# EAGLE design MRCS-Enhanced-Optical-Position-Detector (EAGLE 7.7.0)
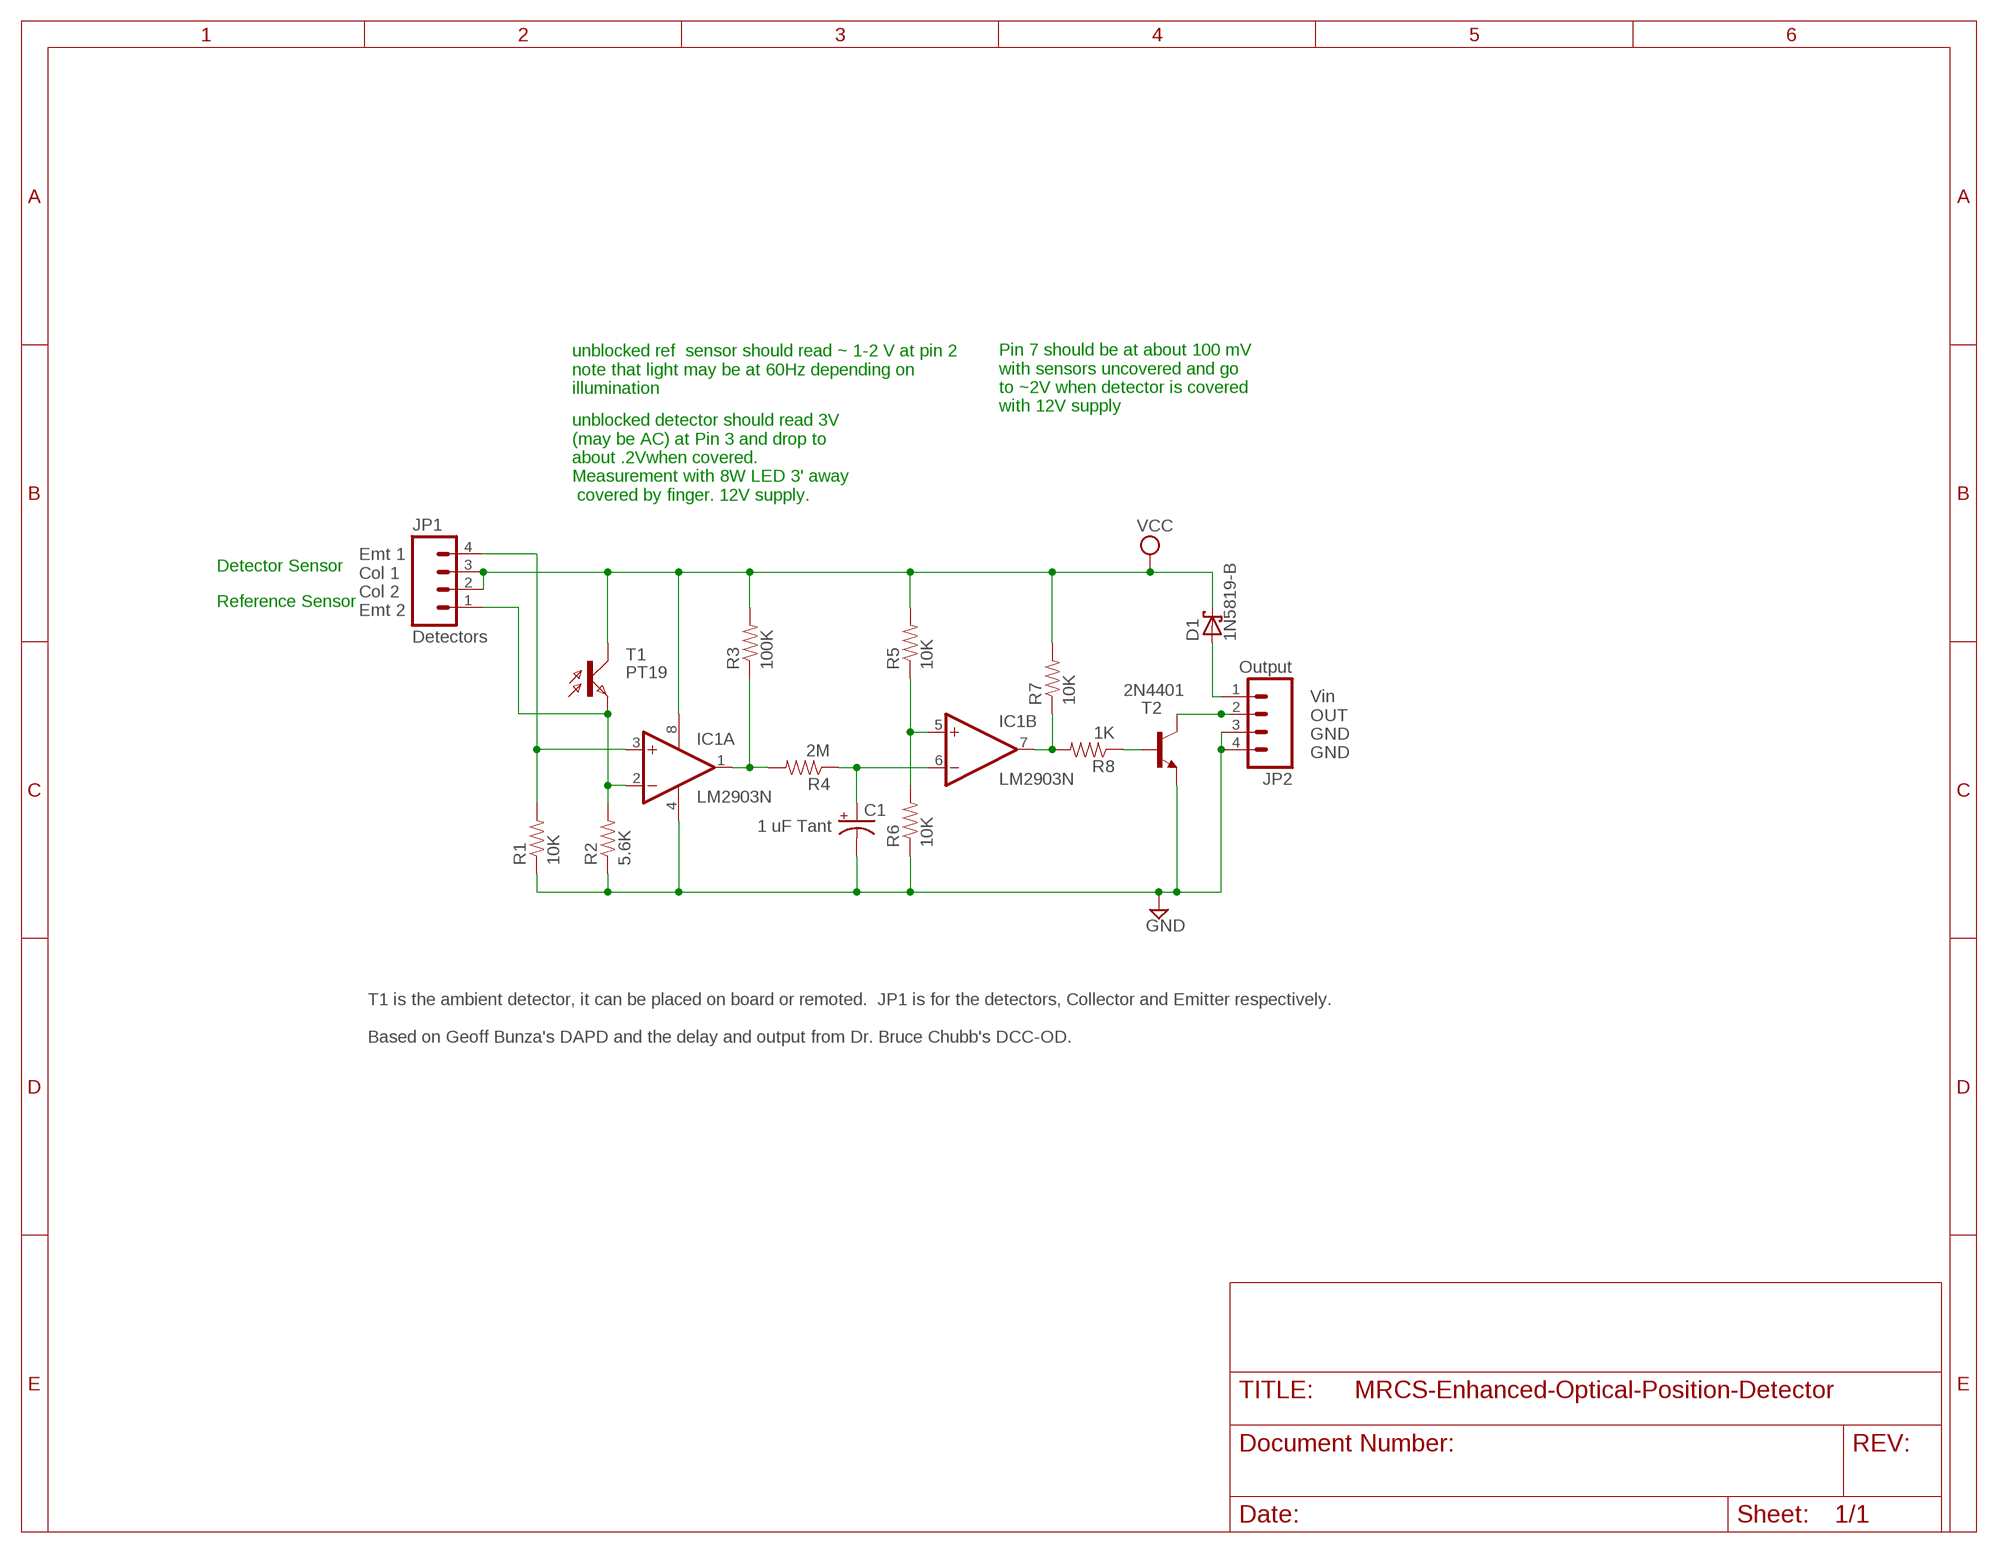
[diagram p0: schematic, sheet 1]

## Parts
C1  1 uF Tant  CPOL-USE2.5-5  [E2,5-5]
D1  1N5819-B  [DO41-7.6]
IC1  LM2903N  [DIL08]
JP1  Detectors  M04LOCK  [1X04_LOCK]
JP2  Output  M04LOCK  [1X04_LOCK]
R1  10K  RESISTORPTH-1/4W  [AXIAL-0.4]
R2  5.6K  RESISTORPTH-1/4W  [AXIAL-0.4]
R3  100K  RESISTORPTH-1/4W  [AXIAL-0.4]
R4  2M  RESISTORPTH-1/4W  [AXIAL-0.4]
R5  10K  RESISTORPTH-1/4W  [AXIAL-0.4]
R6  10K  RESISTORPTH-1/4W  [AXIAL-0.4]
R7  10K  RESISTORPTH-1/4W  [AXIAL-0.4]
R8  1K  RESISTORPTH-1/4W  [AXIAL-0.4]
T1  PT19  BPX81  [BPX81]
T2  2N4401  2N3904-NPN-TO92-EBC  [TO92-EBC]

## Nets
GND: C1.- IC1.4(P:V-) JP2.3 JP2.4 R1.P$1 R2.P$1 R6.P$1 T2.E
N$1: IC1.2(A:-IN) JP1.1 R2.P$2 T1.E
N$2: C1.+ IC1.6(B:-IN) R4.P$1
N$3: IC1.3(A:+IN) JP1.4 R1.P$2
N$4: IC1.1(A:OUT) R3.P$1 R4.P$2
N$5: IC1.7(B:OUT) R7.P$1 R8.P$2
N$6: IC1.5(B:+IN) R5.P$1 R6.P$2
N$7: R8.P$1 T2.B
N$8: JP2.2 T2.C
VCC: D1.C IC1.8(P:V+) JP1.2 JP1.3 R3.P$2 R5.P$2 R7.P$2 T1.C
VIN: D1.A JP2.1

## Notes on the sheet
- unblocked ref  sensor should read ~ 1-2 V at pin 2
  note that light may be at 60Hz depending on
  illumination
- Pin 7 should be at about 100 mV
  with sensors uncovered and go
  to ~2V when detector is covered
  with 12V supply
- unblocked detector should read 3V 
  (may be AC) at Pin 3 and drop to
  about .2Vwhen covered.
  Measurement with 8W LED 3' away
   covered by finger. 12V supply.
- Detector Sensor
- Reference Sensor
- Emt 1
  Col 1
  Col 2
  Emt 2
- Vin
  OUT
  GND
  GND
- T1 is the ambient detector, it can be placed on board or remoted.  JP1 is for the detectors, Collector and Emitter respectively.
  
  Based on Geoff Bunza's DAPD and the delay and output from Dr. Bruce Chubb's DCC-OD.

## Library data of the parts
C1 = rcl:CPOL-US: POLARIZED CAPACITOR, American symbol
D1 = diode:1N581*: 1.0A SCHOTTKY BARRIER RECTIFIER Source: http://www.diodes.com/datasheets/ds23001.pdf
IC1 = linear:LM2903: COMPARATOR
JP1 JP2 = SparkFun-Connectors:M04: Header 4 Standard 4-pin 0.1" header. Use with straight break away headers (SKU : PRT-00116), right angle break away headers (PRT-00553), swiss pins (PRT-00743), machine pins (PRT-00117), and female headers (PRT-00115). Molex polarized connector foot print use with SKU : PRT-08231 with associated crimp pins and housings. 1MM SMD Version SKU: PRT-10208
R1-R8 = SparkFun-Resistors:RESISTOR: Resistor Basic schematic elements and footprints for 0603, 1206, and PTH resistors.
T1 = opto-trans-siemens:BPX81: PHOTO TRANSISTOR; OC_FARNELL: unknown; OC_NEWARK: unknown
T2 = transistor-neu-to92:*-NPN-: NPN Transistror

## Board
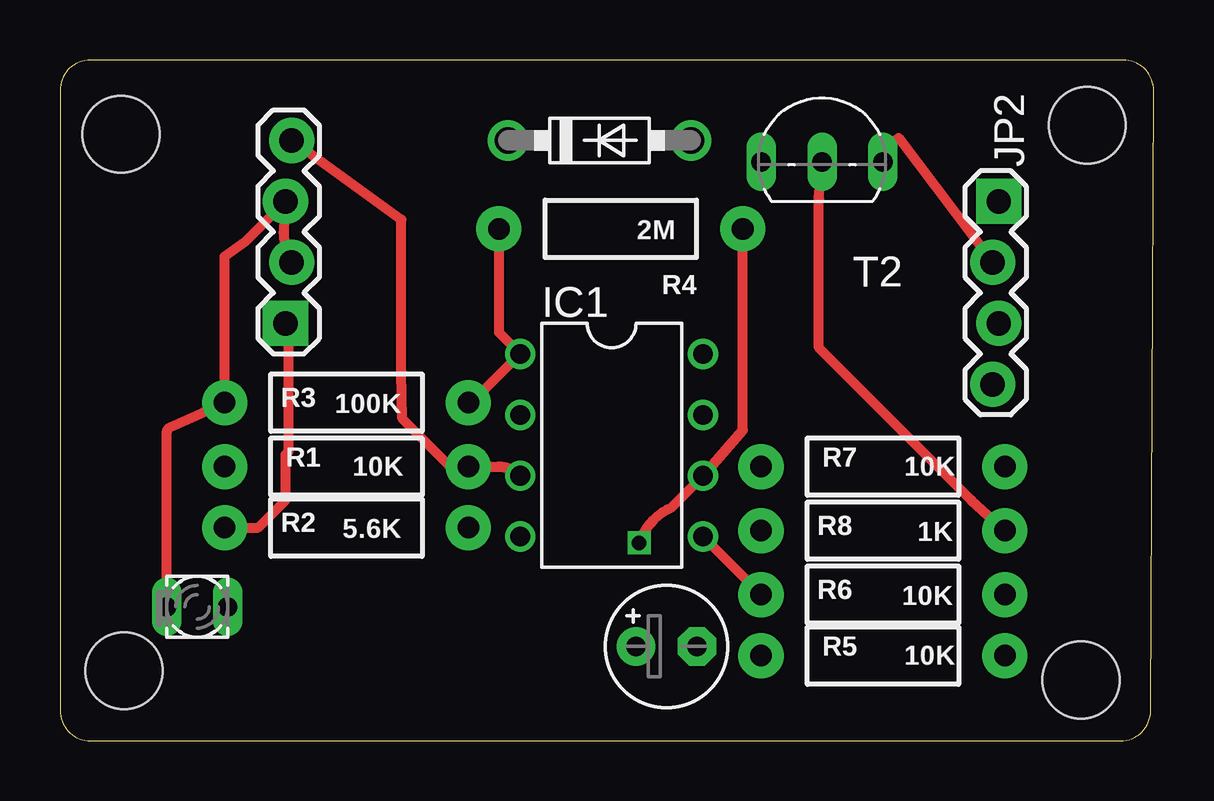
[diagram p1: board, top side]
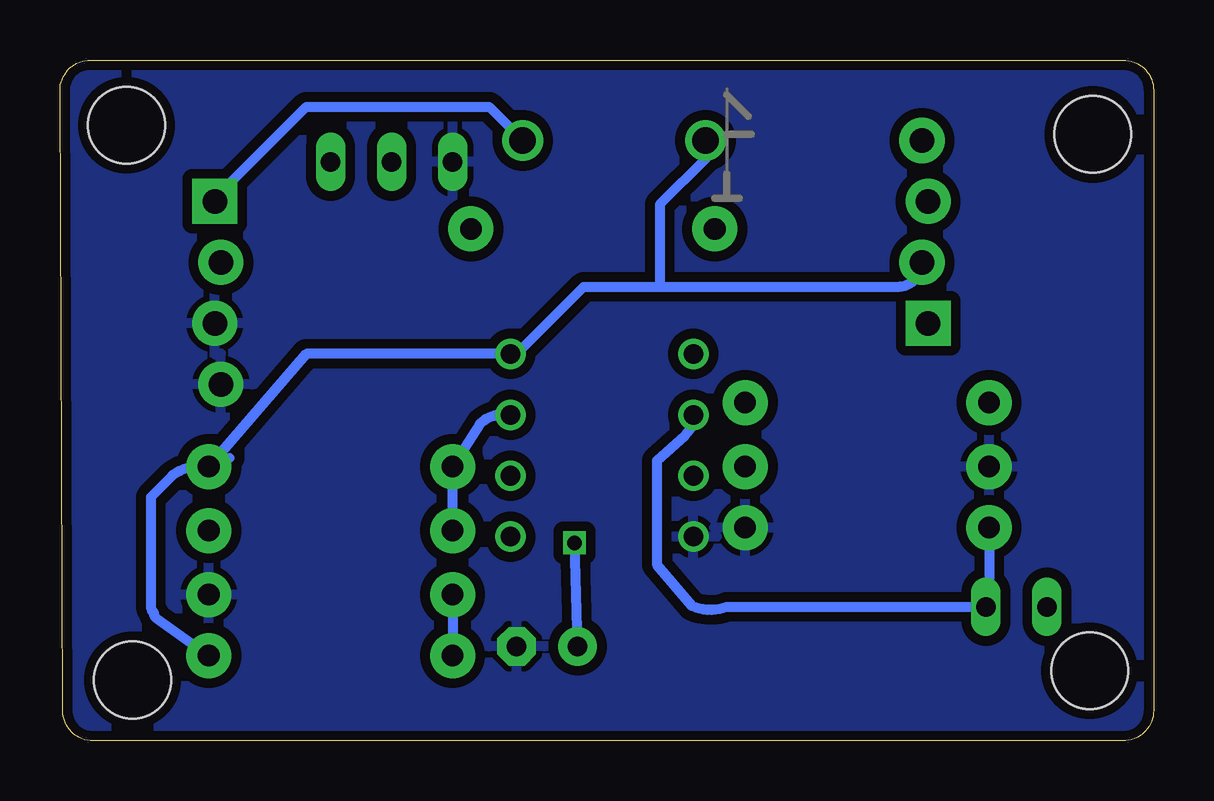
[diagram p2: board, bottom side, seen from below]

Size 45.57 x 28.37 mm. Coordinates in mm from the lower left corner, seen from the top.
Outline: 0,27.1 0,1.27 arc90 1.27,0 44.18,0 arc90 45.45,1.26 45.57,27.1 arc90 44.3,28.37 1.27,28.37 arc90 0,27.1
Copper layers (1*16): Top 0.0356mm / dielectric 1.5011mm / Bottom 0.0356mm
Design rules "LaenPCBOrder": minimum track width 6mil, minimum drill 13mil, track to track 6mil, track to pad 6mil, pad to pad 6mil, via to via 6mil, smd to smd 6mil, copper to edge 15mil, drill to drill 6mil, minimum pad ring 7mil, minimum via ring 7mil, stop-mask expansion 4mil, vias tented up to drill 0mil, thermal gap 10mil
Holes 3.2 mm at 2.54,25.27 42.8,25.65 2.67,2.92 42.54,2.54

### Footprints (pad centres in the part's own frame; a part is rotated, then mirrored left to right if it is on the bottom)
E2,5-5 = drill 0.813 pad 1.6: + -1.27,0 | drill 0.813 pad 1.6 octagon: - 1.27,0
DO41-7.6 = drill 1.1 pad 1.7: A 3.81,0; C -3.81,0
DIL08 = drill 0.813 pad 1.27: 1 -3.81,-3.81; 2 -1.27,-3.81; 3 1.27,-3.81; 4 3.81,-3.81; 5 3.81,3.81; 6 1.27,3.81; 7 -1.27,3.81; 8 -3.81,3.81
1X04_LOCK = drill 1.016 pad 1.88 square: 1 0,0.127 | drill 1.016 pad 1.88: 2 2.54,-0.127; 3 5.08,0.127; 4 7.62,-0.127
AXIAL-0.4 = drill 0.9 pad 1.88: P$1 -5.08,0; P$2 5.08,0
BPX81 = drill 0.813 long: C 1.27,0; E -1.27,0
TO92-EBC = drill 0.813 long: B 0,-1.27; C 2.54,-1.27; E -2.54,-1.27

### Placement (x,y rotation side)
C1  25.27,3.94 0 top
D1  22.48,25.02 0 top
IC1  22.99,12.32 270 top
JP1  9.52,17.4 90 top
JP2  38.99,22.48 270 top
R1  11.94,11.43 0 top
R2  11.94,8.89 180 top
R3  11.94,14.1 180 top
R4  23.37,21.34 180 top
R5  34.29,3.56 0 top
R6  34.29,6.1 180 top
R7  34.29,11.43 0 top
R8  34.29,8.76 180 top
T1  5.71,5.59 180 top
T2  31.75,25.4 0 top
U$1  [MRCSLOGOBTM]  11.43,22.1 0 top
U$3  [CA-PROP65WARNING]  35.56,16.76 90 top

### Tracks (layer width: path | path; a pad name or v marks a point on that pad's centre or on a via)
GND
  pour Bottom (isolate 0.406): 0.38,28.7 45.21,28.7 44.96,0.51 0.51,0.51
N$1
  Top 0.406: JP1.1 9.43,16.73 arc-45 9.52,16.51 9.52,12.06 9.4,11.94 9.4,10.03 8.25,8.89 R2.P$2
  Bottom 0.406: IC1.2 arc45 19.54,12.72 20.7,11.68 20.7,7.34 19.23,5.62 arc-45 17.78,5.59 T1.E 6.86,5.71 R2.P$2
N$2  (via drill 0.6)
  Top 0.406: R4.P$1 28.45,12.95 IC1.6 25.49,9.74 arc45 v24.13,8.25
  Bottom 0.406: C1.+ v24.13,8.25
N$3
  Top 0.406: IC1.3 IC1.3 arc45 18.27,11.43 R1.P$2 16.51,11.43 16.38,11.3 14.26,13.42 14.22,15.37 14.22,21.72 JP1.4
N$4
  Top 0.406: R4.P$2 18.29,17.02 IC1.1 17.14,14.1 R3.P$1
N$5
  Bottom 0.406: R8.P$2 R7.P$1 28.06,13.22 arc45 27.16,13.59 IC1.7
N$6
  Top 0.406: IC1.5 R6.P$2
  Bottom 0.406: R6.P$2 R5.P$1
N$7
  Top 0.406: R8.P$1 37.97,10.03 31.62,16.38 31.62,22.61 T2.B
N$8
  Top 0.406: T2.C arc-45 34.94,25.13 JP2.2
VCC
  Top 0.406: T1.C 4.45,12.83 arc-45 4.54,13.04 R3.P$2 6.86,20.19 7.75,20.83 JP1.3 9.4,21.82 arc45 JP1.2
  Bottom 0.406: R7.P$2 arc-45 38.5,11.79 | R7.P$2 arc-45 40.87,11.07 41.78,10.16 41.78,5.64 arc-45 41.66,5.33 arc-45 41.57,5.12 R5.P$2 | 20.7,18.92 23.75,18.92 26.36,16.31 arc45 IC1.8 35.31,16.13 R7.P$2 | 20.7,18.92 10.67,18.92 arc-90 JP1.2 | D1.C 18.67,24.26 20.57,22.35 20.57,19.05 20.7,18.92
VIN
  Bottom 0.406: JP2.1 39.12,22.61 35.31,26.42 27.69,26.42 D1.A

### Text on the board
tDocu: E1 / C1 / C2 / E2 | Vin / OUT / GND / GND | rev 4 20201119 | EOPD Geoff Bunza 2015, / Seth Neumann 2020
bDocu: MRCS DAPD-DFM / Based on Geoff Bunza 2015
_tNames: JP2 | R4 | T2 | IC1 | R3 | R1 | R7 | R2 | R8 | R6 | R5
_tDocu: C1